# EasyEDA schematic SCH_7.5寸墨水屏_请用立创EDA打开.json
TITLE: Sheet_1; REV: 1.0; Date: 2021-11-21; Sheet: 1/1; Drawn By: sammax; Company: Your Company
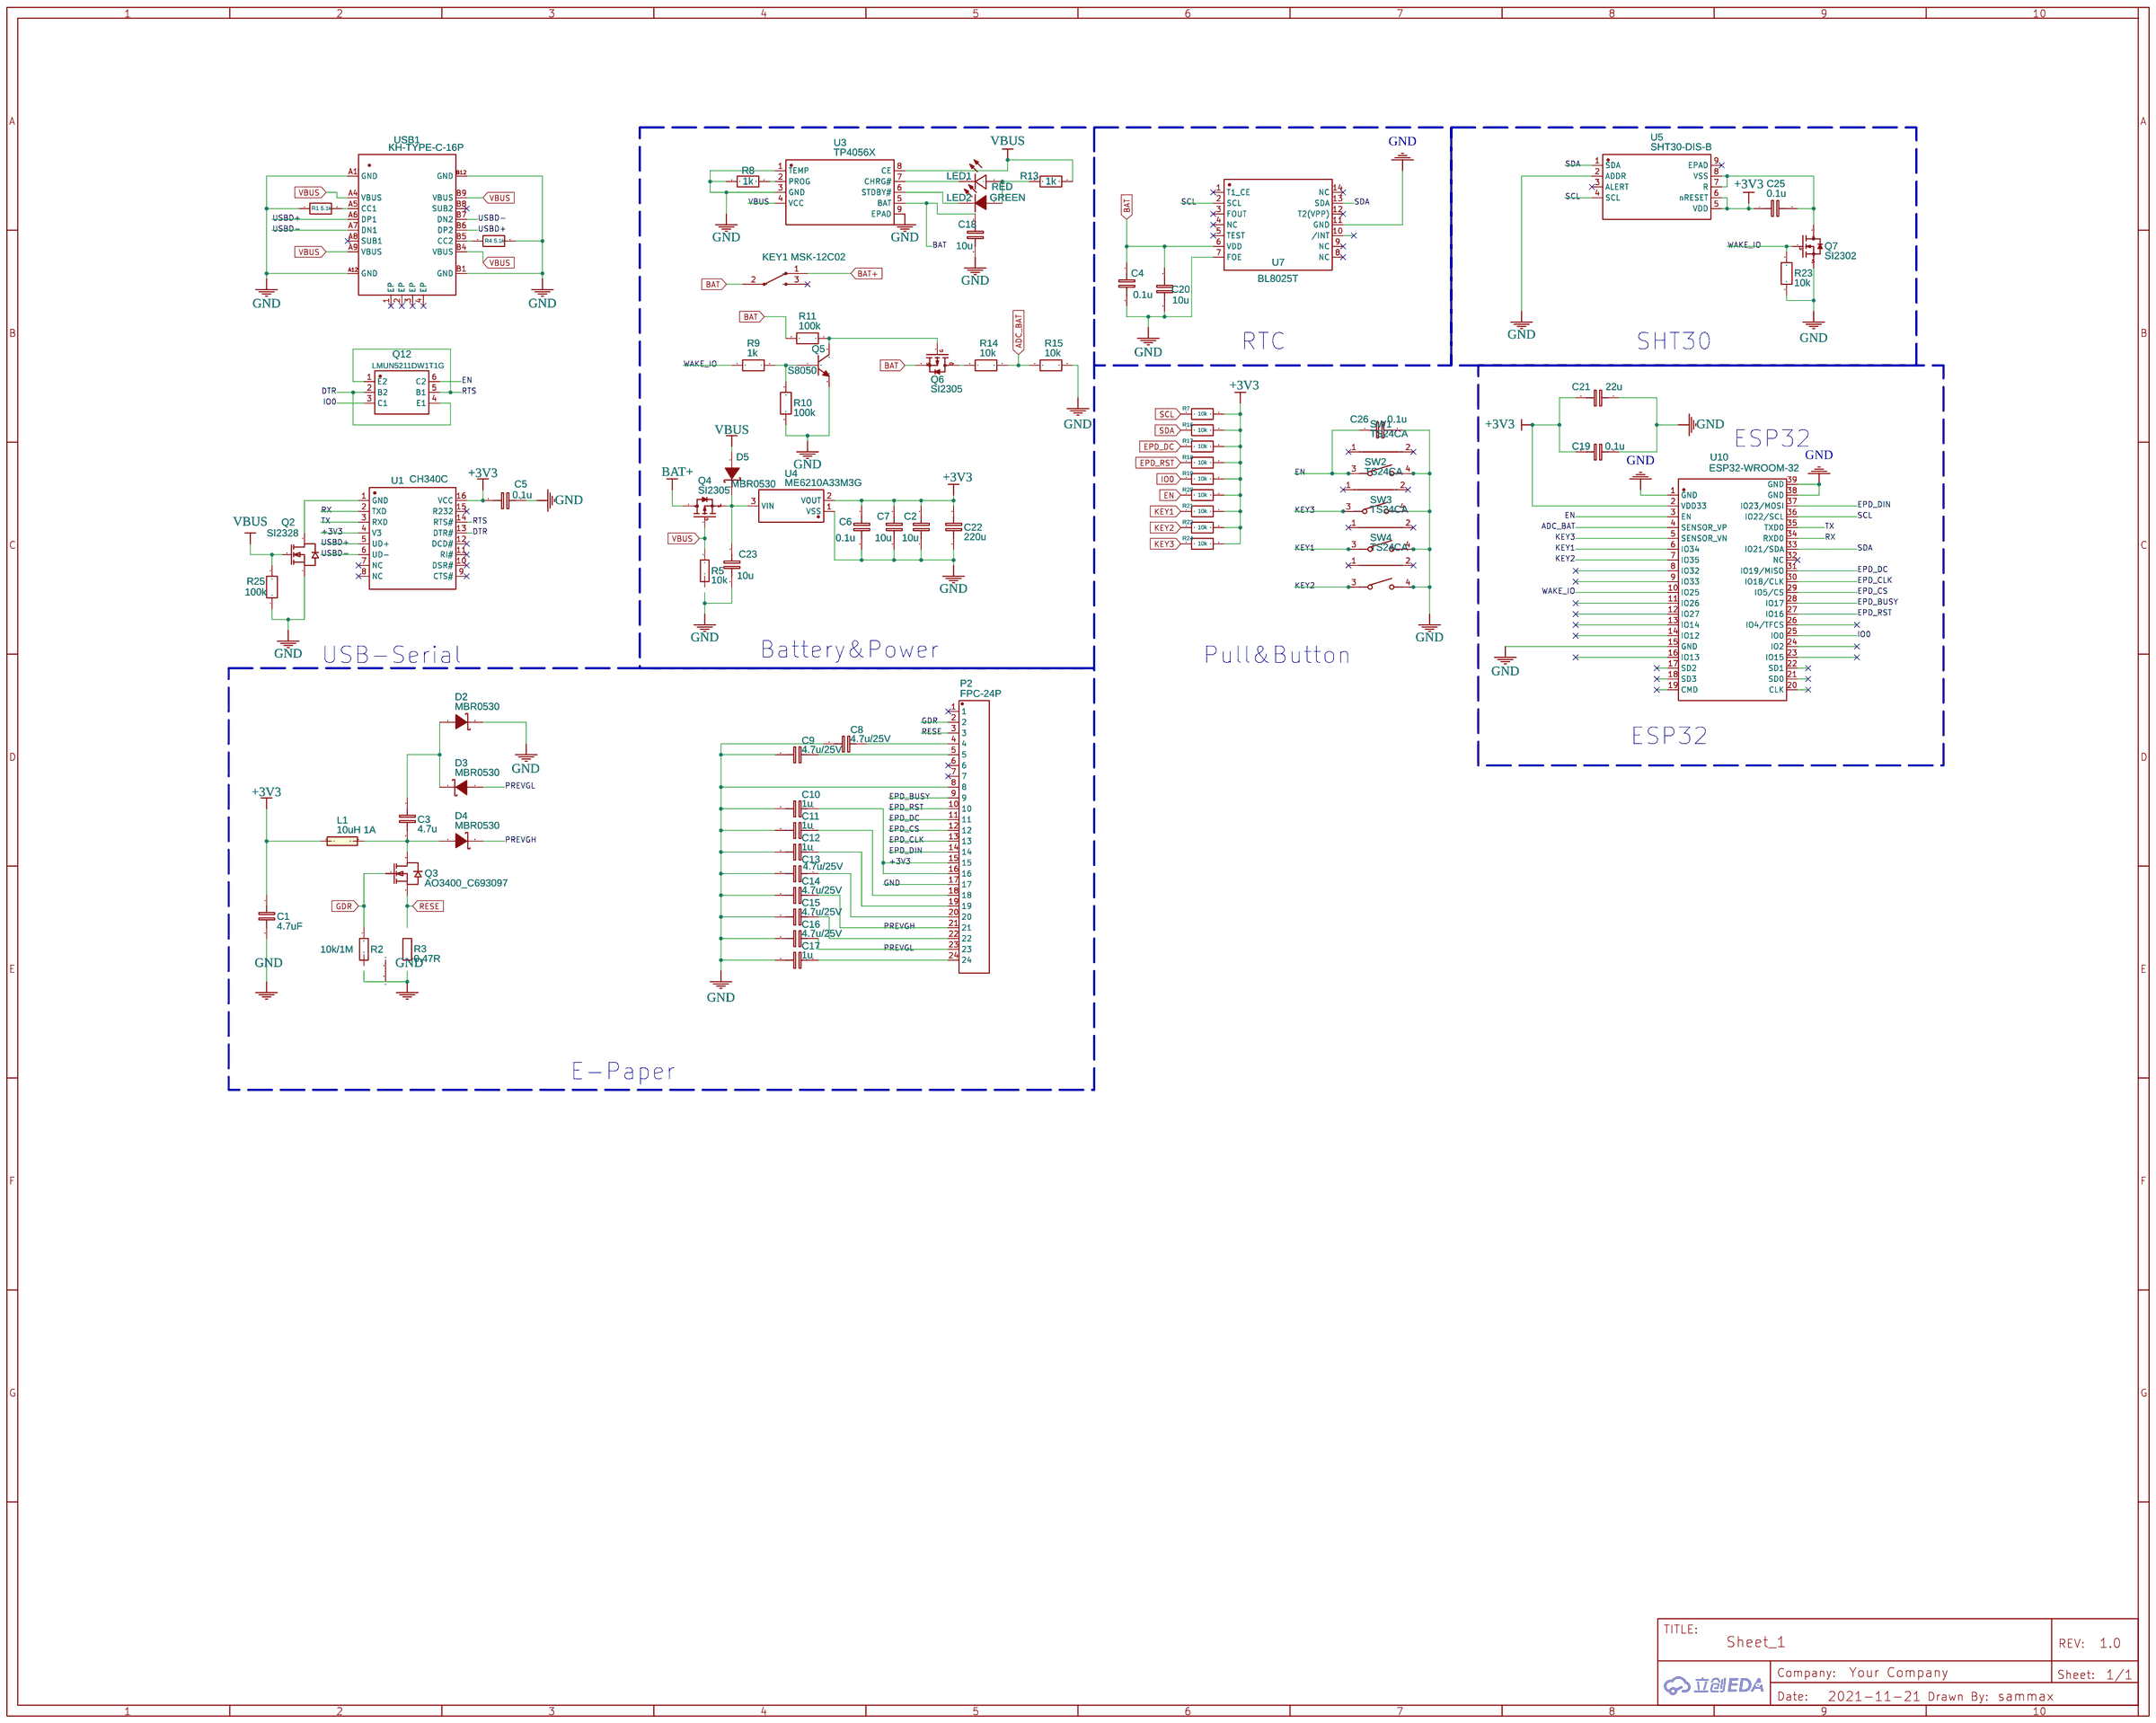
[diagram p0: schematic sheet]

## Parts
C1  4.7uF  [C0603]
C2  10u  [C0603]
C3  4.7u  [C0603]
C4  0.1u  [C0603]
C5  0.1u  [C0603]
C6  0.1u  [C0603]
C7  10u  [C0603]
C8  4.7u/25V  [C0603]
C9  4.7u/25V  [C0603]
C10  1u  [C0603]
C11  1u  [C0603]
C12  1u  [C0603]
C13  4.7u/25V  [C0603]
C14  4.7u/25V  [C0603]
C15  4.7u/25V  [C0603]
C16  4.7u/25V  [C0603]
C17  1u  [C0603]
C18  10u  [C0603]
C19  0.1u  [C0603]
C20  10u  [C0603]
C21  22u  [C0603]
C22  220u  [CASE-B_3528]
C23  10u  [C0603]
C25  0.1u  [C0603]
C26  0.1u  [C0603]
D2  MBR0530  [SOD-123]
D3  MBR0530  [SOD-123]
D4  MBR0530  [SOD-123]
D5  MBR0530  [SOD-123]
KEY1  MSK-12C02  [MSK-11027]
L1  10uH 1A  [C-CD32电感]
LED1  RED  [LED0603-R-RD]
LED2  GREEN  [LED0603-R-RD]
P2  FPC-24P  [FPC-0.5MM-LSSJ-H2.0-24P]
Q2  SI2328  [SOT-23_L2.9-W1.3-P1.90-LS2.4-BR]
Q3  AO3400_C693097  [SOT-23-3_L2.9-W1.6-P1.90-LS2.8-BR]
Q4  SI2305  [SOT-23-3_L2.9-W1.3-P1.90-LS2.4-BR]
Q5  S8050  [SOT-23(SOT-23-3)]
Q6  SI2305  [SOT-23-3_L2.9-W1.3-P1.90-LS2.4-BR]
Q7  SI2302  [SOT-23-3_L2.9-W1.3-P1.90-LS2.4-BR]
Q12  LMUN5211DW1T1G  [SC-88-6_L2.0-W1.3-P0.65-LS2.1-BL]
R1  5.1k  [R0603]
R2  10k/1M  [R0603]
R3  0.47R  [R0603]
R4  5.1k  [R0603]
R5  10k  [R0603]
R7  10k  [R0603]
R8  1k  [R0603]
R9  1k  [R0603]
R10  100k  [R0603]
R11  100k  [R0603]
R13  1k  [R0603]
R14  10k  [R0603]
R15  10k  [R0603]
R16  10k  [R0603]
R17  10k  [R0603]
R18  10k  [R0603]
R19  10k  [R0603]
R20  10k  [R0603]
R21  10k  [R0603]
R22  10k  [R0603]
R23  10k  [R0603]
R24  10k  [R0603]
R25  100k  [R0603]
SW1  TS24CA  [SW-SMD_TS24CA]
SW2  TS24CA  [SW-SMD_TS24CA]
SW3  TS24CA  [SW-SMD_TS24CA]
SW4  TS24CA  [SW-SMD_TS24CA]
U1  CH340C  [SOP-16_150MIL]
U3  TP4056X  [SOP-8_L4.9-W3.9-P1.27-LS6.0-BL-EP]
U4  ME6210A33M3G  [SOT-23-3_L3.0-W1.7-P0.95-LS2.9-BR]
U5  SHT30-DIS-B  [DFN-8_L2.5-W2.5-P0.50-BL-EP]
U7  BL8025T  [SOP-14_L10.3-W5.3-P1.27-LS7.8-BL]
U10  ESP32-WROOM-32  [WIFIM-SMD_39P-L25.5-W18.0-P1.27]
USB1  KH-TYPE-C-16P  [USB-C-SMD_KH-TYPE-C-16P]

## Library data of the parts
C1 C2 C4-C7 C18-C21 C23 C26 = Capacitor: Manufacturer Part: CL10A475MP5LNNC; Supplier: LCSC; Manufacturer: Samsung Electro-Mechanics; Supplier Part: C318644
C3 C10 = Capacitor: Manufacturer Part: CT41-0603-2F4-50V-0.1uF-M(N); Supplier: LCSC; Manufacturer: TORCH; Supplier Part: C138344
C8 C9 C11-C17 = Capacitor
C22 = Capacitor: Manufacturer Part: CA45-B-6.3V-100uF-K; Supplier: LCSC; Manufacturer: CEC; Supplier Part: C129289
C25 = Cap_0603_EU: Manufacturer Part: CT41-0603-2F4-50V-0.1uF-M(N); Supplier: LCSC; Manufacturer: TORCH; Supplier Part: C138344
D2-D5 = -: Supplier: LCSC; Supplier Part: C77336
KEY1 = -: Supplier: LCSC; Manufacturer: SHOU HAN; Manufacturer Part: MSK12C02; Supplier Part: C431540
L1 = Inductor: Manufacturer Part: CB2012T680K; Supplier: LCSC; Manufacturer: Taiyo Yuden; Supplier Part: C223178
LED1 = E6C0603URAC1UDA: Supplier: LCSC; Supplier Part: C375444; Manufacturer: EKINGLUX; Contributor: LCSC
LED2 = ORH-G36G: Supplier: LCSC; Supplier Part: C205443; Manufacturer: Orient; Contributor: LCSC; SMT Type: Extend; JLCPCB SMD: Yes
P2 = -: Supplier: LCSC; Manufacturer Part: ?; Supplier Part: C11092
Q2 = SI2328: Supplier: LCSC; Supplier Part: C344007; Manufacturer: Bourne Semicon (Shenzhen); Contributor: LCSC; JLCPCB Part Class: Extended Part
Q3 = AO3400_C693097: Supplier: LCSC; Supplier Part: C693097; Manufacturer: VBsemi Elec; Manufacturer Part: AO3400; Contributor: LCSC; JLCPCB Part Class: Extended Part
Q4 Q6 = SI2305: Supplier: LCSC; Manufacturer: Hottech; Contributor: LCSC; Supplier Part: C181088; LCSC Assembly: Yes; SMT Type: Extend
Q5 = -: Supplier: LCSC; Manufacturer: Yenji; Contributor: LCSC; Supplier Part: C139514; LCSC Assembly: Yes; SMT Type: Extend
Q7 = SI2302: Supplier: LCSC; Manufacturer: Hottech; Contributor: LCSC; Supplier Part: C181087; LCSC Assembly: Yes; SMT Type: Extend
Q12 = LMUN5211DW1T1G: Supplier: LCSC; Supplier Part: C417319; Manufacturer: Leshan Radio; Contributor: LCSC; JLCPCB Part Class: Extended Part
R1 R4 R8 R13 R23 R25 = R_0603_EU: Contributor: LCEDA_Lib
R2 R5 = Resistor: Manufacturer Part: CRCW060310K0JNEA; Supplier: LCSC; Manufacturer: Vishay Intertech; Supplier Part: C169103
R3 = Resistor: Manufacturer Part: CR0603F0R47P05; Supplier: LCSC; Manufacturer: Ever Ohms Tech; Supplier Part: C175657
R7 R14 R16-R22 R24 = R_0603_EU: Supplier Part: C269694; Supplier: LCSC; Contributor: LCEDA_Lib; Manufacturer Part: RMC06034.7k5%N; Manufacturer: Tyohm
R9 R15 = R_0603_EU: Supplier Part: C267568; Supplier: LCSC; Contributor: LCEDA_Lib; Manufacturer Part: R0603RXX102XF10LTS; Manufacturer: Shenzhen Eyang Tech Development
R10 = R_0603_EU: Supplier Part: C328419; Supplier: LCSC; Contributor: LCEDA_Lib; Manufacturer Part: PTFR0603B100KP9; Manufacturer: ResistorToday
R11 = R_0603_EU: Supplier Part: C169103; Supplier: LCSC; Contributor: LCEDA_Lib; Manufacturer Part: CRCW060310K0JNEA; Manufacturer: Vishay Intertech
SW1-SW4 = TS24CA: Supplier: LCSC; Supplier Part: C393942; Manufacturer: SHOU HAN; Contributor: LCSC; JLCPCB Part Class: Extended Part
U1 = -: Supplier: LCSC; Manufacturer: WCH; Supplier Part: C84681
U3 = TP4056X: Supplier: LCSC; Supplier Part: C191323; Manufacturer: Nanjing Extension Microelectronics; Contributor: LCSC
U4 = ME6210A33M3G: Supplier: LCSC; Supplier Part: C236680; Manufacturer: Nanjing Micro One Elec; Contributor: LCSC; JLCPCB Part Class: Extended Part
U5 = SHT30-DIS-B: Supplier: LCSC; Manufacturer: Sensirion; image: //image.lceda.cn/szlcsc/C77361.jpg; Supplier Part: C77361
U7 = BL8025T: Supplier: LCSC; Manufacturer: BL; Supplier Part: C79083; JLCPCB Part Class: Extended Part
U10 = ESP32-WROOM-32: Supplier: LCSC; Supplier Part: C503587; Manufacturer: Espressif Systems; Contributor: LCSC
USB1 = KH-TYPE-C-16P: Supplier: LCSC; Supplier Part: C709357; Manufacturer: Shenzhen Kinghelm Elec; Contributor: LCSC

## Nets
+3V3: C1.1 C2.1 C5.2 C6.1 C7.1 C10.1 C19.2 C21.2 C22.1 C25.1 L1.1 P2.15 P2.16 R7.2 R16.2 R17.2 R18.2 R19.2 R20.2 R21.2 R22.2 R24.2 U1.4(V3) U1.16(VCC) U4.2(VOUT) U5.5(VDD) U5.6(nRESET) U10.2(VDD33)
GND: C1.2 C2.2 C4.2 C5.1 C6.2 C7.2 C8.2 C9.2 C10.2 C11.2 C12.2 C13.2 C14.2 C15.2 C16.2 C17.2 C18.2 C19.1 C20.2 C21.1 C22.2 C23.2 C26.2 D2.2(K) P2.8 P2.17 Q2.2(S) Q5.2(E) Q7.2(S) R1.1 R2.2 R3.1 R4.2 R5.2 R8.2 R10.1 R15.2 R23.1 R25.1 SW1.4 SW2.4 SW3.4 SW4.4 U3.1(TEMP) U3.3(GND) U3.9(EPAD) U4.1(VSS) U5.2(ADDR) U7.7(FOE) U7.11(GND) U10.1(GND) U10.15(GND) U10.38(GND) U10.39(GND) USB1.A1(GND) USB1.A12(GND) USB1.B1(GND) USB1.B12(GND)
VBUS: D5.1(A) Q2.1(G) Q4.1(G) R5.1 R13.2 R25.2 U3.4(VCC) U3.8(CE) USB1.A4(VBUS) USB1.A9(VBUS) USB1.B4(VBUS) USB1.B9(VBUS)
ADC_BAT: R14.2 R15.1 U10.4(SENSOR_VP)
BAT: C4.1 C18.1 C20.1 KEY1.2 Q6.2(S) R11.2 U3.5(BAT) U7.6(VDD)
BAT+: KEY1.1 Q4.3(D)
DTR: Q12.2(B2) Q12.4(E1) U1.13(DTR#)
EN: C26.1 Q12.6(C2) R20.1 SW1.3 U10.3(EN)
EPD_BUSY: P2.9 U10.28(IO17)
EPD_CLK: P2.13 U10.30(IO18/CLK)
EPD_CS: P2.12 U10.29(IO5/CS)
EPD_DC: P2.11 R17.1 U10.31(IO19/MISO)
EPD_DIN: P2.14 U10.37(IO23/MOSI)
EPD_RST: P2.10 R18.1 U10.27(IO16)
GDR: P2.2 Q3.1(G) R2.1
IO0: Q12.3(C1) R19.1 U10.25(IO0)
KEY1: R21.1 SW3.3 U10.6(IO34)
KEY2: R22.1 SW4.3 U10.7(IO35)
KEY3: R24.1 SW2.3 U10.5(SENSOR_VN)
PREVGH: C14.1 D4.2(K) P2.21
PREVGL: C16.1 D3.1(A) P2.23
RESE: P2.3 Q3.2(S) R3.2
RTS: Q12.1(E2) Q12.5(B1) U1.14(RTS#)
RX: U1.2(TXD) U10.34(RXD0)
SCL: R7.1 U5.4(SCL) U7.2(SCL) U10.36(IO22/SCL)
SDA: R16.1 U5.1(SDA) U7.13(SDA) U10.33(IO21/SDA)
TX: U1.3(RXD) U10.35(TXD0)
USBD+: U1.5(UD+) USB1.A6(DP1) USB1.B6(DP2)
USBD-: U1.6(UD-) USB1.A7(DN1) USB1.B7(DN2)
WAKE_IO: Q7.1(G) R9.2 R23.2 U10.10(IO25)
Net-(C3-1): C3.1 D2.1(A) D3.2(K)
Net-(C3-2): C3.2 D4.1(A) L1.2 Q3.3(D)
Net-(C8-1): C8.1 P2.4
Net-(C9-1): C9.1 P2.5
Net-(C11-1): C11.1 P2.18
Net-(C12-1): C12.1 P2.19
Net-(C13-1): C13.1 P2.20
Net-(C15-1): C15.1 P2.22
Net-(C17-1): C17.1 P2.24
Net-(C23-1): C23.1 D5.2(K) Q4.2(S) U4.3(VIN)
Net-(C25-2): C25.2 Q7.3(D) U5.7(R) U5.8(VSS)
Net-(LED1-1): LED1.1(+) LED2.1(A) R13.1
Net-(LED1-2): LED1.2(-) U3.7(CHRG#)
Net-(LED2-2): LED2.2(K) U3.6(STDBY#)
Net-(Q2-3): Q2.3(D) U1.1(GND)
Net-(Q5-1): Q5.1(B) R9.1 R10.2
Net-(Q5-3): Q5.3(C) Q6.1(G) R11.1
Net-(Q6-3): Q6.3(D) R14.1
Net-(R1-2): R1.2 USB1.A5(CC1)
Net-(R4-1): R4.1 USB1.B5(CC2)
Net-(R8-1): R8.1 U3.2(PROG)

Not connected (* = marked no-connect by the designer): KEY1 3*; P2 1* 6* 7*; SW1 1* 2*; SW2 1* 2*; SW3 1* 2*; SW4 1* 2*; U1 7(NC)* 8(NC)* 9(CTS#)* 10(DSR#)* 11(RI#)* 12(DCD#)* 15(R232)*; U5 3(ALERT)* 9(EPAD)*; U7 1(T1_CE)* 3(FOUT)* 4(NC)* 5(TEST)* 8(NC)* 9(NC)* 10(/INT) 12(T2(VPP))* 14(NC)*; U10 8(IO32) 9(IO33) 11(IO26) 12(IO27) 13(IO14) 14(IO12) 16(IO13) 17(SD2) 18(SD3) 19(CMD) 20(CLK) 21(SD0) 22(SD1) 23(IO15) 24(IO2) 26(IO4/TFCS) 32(NC)*; USB1 1(EP)* 2(EP)* 3(EP)* 4(EP)* A8(SUB1)* B8(SUB2)*

## Notes on the sheet
- RTC
- SHT30
- ESP32
- USB-Serial
- Battery&Power
- Pull&Button
- ESP32
- E-Paper
